# Altium schematic sheet Dcdc.12V0.-16V5.SchDoc
size A4
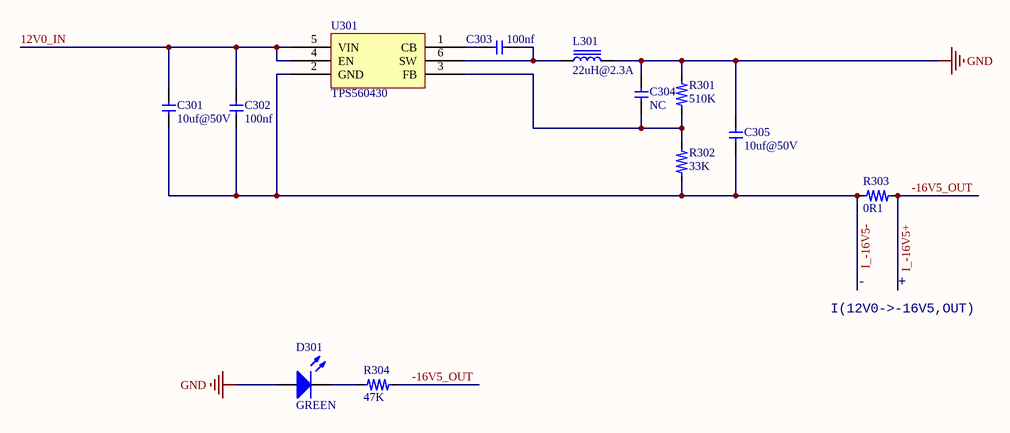
[diagram p0: Dcdc.12V0.-16V5.SchDoc]

## Parts
C301  value 10uf@50V  [C1210]  (hidden comment: Cap)
C302  value 100nf  [C0603]  (hidden comment: Cap)
C303  value 100nf  [C0603]  (hidden comment: Cap)
C304  value NC  [C0603]  (hidden comment: Cap)
C305  value 10uf@50V  [C1210]  (hidden comment: Cap)
D301  value GREEN  [LED0603]  (hidden comment: LED)
L301  value 22uH@2.3A  [L06063]  (hidden comment: Inductor Iron)
R301  value 510K  [R0603]  (hidden comment: Res)
R302  value 33K  [R0603]  (hidden comment: Res)
R303  value 0R1  [R1206]  (hidden comment: Res)
R304  value 47K  [R0603]  (hidden comment: Res)
U301  TPS560430  [TPS560430-SOT23-6]

## Nets
GND: C304.1 C305.2 D301.1(A) L301.2 R301.2
12V0_IN: C301.2 C302.2 U301.4(EN) U301.5(VIN)
-16V5_OUT: R303.1 R304.1  [also labelled I_-16V5+]
I_-16V5-: C301.1 C302.1 C305.1 R302.1 R303.2 U301.2(GND)
NetC303_1: C303.1 L301.1 U301.6(SW)
NetC303_2: C303.2 U301.1(CB)
NetC304_2: C304.2 R301.1 R302.2 U301.3(FB)
NetD301_2: D301.2(K) R304.2

## Notes on the sheet
- I(12V0->-16V5,OUT)
- -
- +

## Library data of the parts
L301 = Inductor Iron: Magnetic-Core Inductor
R301-R304 = Res: 电阻
U301 = TPS560430: TPS560430 SIMPLE SWITCHER® 4-V to 36-V, 600-mA Synchronous Step-Down Converter